# Altium schematic sheet Sheet1.SchDoc
size A4; SheetNumber: 1; SheetTotal: 1
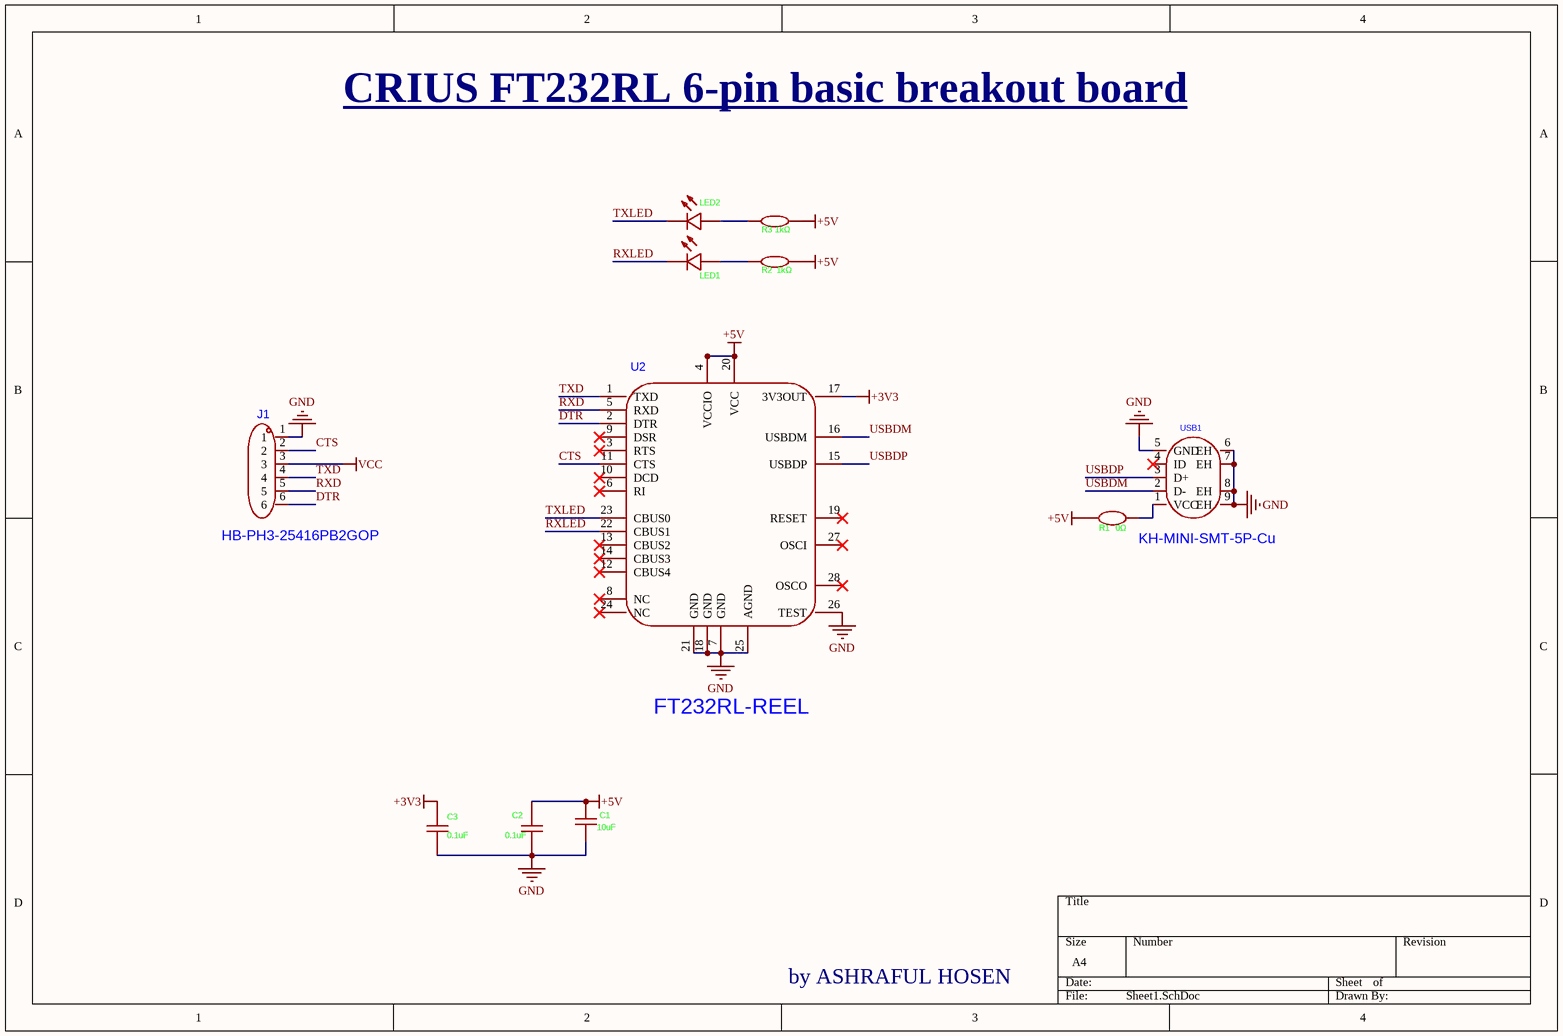
[diagram p0: Sheet1.SchDoc]

## Parts
C1  10uF  [C1206]
C2  0.1uF  [C0603]
C3  0.1uF  [C0603]
J1  HB-PH3-25416PB2GOP  [HDR-TH_6P-P2.54-V-M]
LED1  19-217/R6C-AL1M2VY/3T  [LED0603-RD]  (value not drawn)
LED2  19-217/R6C-AL1M2VY/3T  [LED0603-RD]  (value not drawn)
R1  0Ω  [R0805]
R2  1kΩ  [R0603]
R3  1kΩ  [R0603]
U2  FT232RL-REEL  [SSOP-28_L10.2-W5.3-P0.65-LS7.8-BL]
USB1  KH-MINI-SMT-5P-Cu  [MINI-USB-SMD_KH-MINI-SMT-5P-CU]

## Nets
+3V3: C3.2 U2.17(3V3OUT)
+5V: C1.2 C2.2 R1.1 R2.2 R3.2 U2.4(VCCIO) U2.20(VCC)
GND: C1.1 C2.1 C3.1 J1.1 U2.7(GND) U2.18(GND) U2.21(GND) U2.25(AGND) U2.26(TEST) USB1.5(GND) USB1.6(EH) USB1.7(EH) USB1.8(EH) USB1.9(EH)
VCC: J1.3
CTS: J1.2 U2.11(CTS)
DTR: J1.6 U2.2(DTR)
RXD: J1.5 U2.5(RXD)
RXLED: LED1.1(C) U2.22(CBUS1)
TXD: J1.4 U2.1(TXD)
TXLED: LED2.1(C) U2.23(CBUS0)
USBDM: U2.16(USBDM) USB1.2(D-)
USBDP: U2.15(USBDP) USB1.3(D+)
NetLED1_2: LED1.2(A) R2.1
NetLED2_2: LED2.2(A) R3.1
NetR1_2: R1.2 USB1.1(VCC)

Not connected (* = marked no-connect by the designer): U2 3(RTS)* 6(RI)* 8(NC)* 9(DSR)* 10(DCD)* 12(CBUS4)* 13(CBUS2)* 14(CBUS3)* 19(RESET)* 24(NC)* 27(OSCI)* 28(OSCO)*; USB1 4(ID)*

## Notes on the sheet
- CRIUS FT232RL 6-pin basic breakout board
- by ASHRAFUL HOSEN

## Library data of the parts
C1 = CL31A106KBHNNNE: 50V 10uF X5R ±10% 1206 Multilayer Ceramic Capacitors MLCC - SMD/SMT ROHS; Manufacturer: SAMSUNG(三星); Add into BOM: yes; Symbol: CL31A106KBHNNNE; Device: CL31A106KBHNNNE; LCSC Part Name: 10uF ±10% 50V; Supplier Part: C13585; Manufacturer Part: CL31A106KBHNNNE; Supplier Footprint: 1206; JLCPCB Part Class: Basic Part; Datasheet: https://atta.szlcsc.com/upload/public/pdf/source/20160218/1457707763339.pdf; Supplier: LCSC; Convert to PCB: yes; Value: 10uF; Tolerance: ±10%
C2 C3 = CC0603KRX7R9BB104: 50V 100nF X7R ±10% 0603 Multilayer Ceramic Capacitors MLCC - SMD/SMT ROHS; Manufacturer: YAGEO(国巨); Add into BOM: yes; Symbol: CC0603KRX7R9BB104; Device: CC0603KRX7R9BB104; LCSC Part Name: 100nF ±10% 50V; Supplier Part: C14663; Manufacturer Part: CC0603KRX7R9BB104; Supplier Footprint: 0603; JLCPCB Part Class: Basic Part; Datasheet: https://atta.szlcsc.com/upload/public/pdf/source/20180910/C282072_33301C7F631E79921B82A8DAC6BCC5B3.pdf; Supplier: LCSC; Convert to PCB: yes; Value: 100nF; Tolerance: ±10%; Voltage Rating: 50V; Temperature Coefficient: X7R
J1 = HB-PH3-25416PB2GOP: Gold 250V 3A Through Hole Pin Header 2.54mm 6P 6mm -40℃~+105℃ 3mm 2.54mm Brass Black 1 1x6P 2.54mm Plugin,P=2.54mm Pin Headers ROHS; Manufacturer: HANBO(汉博); Add into BOM: yes; Circluar Pins/Square Pins: Policy; Symbol: HB-PH3-25416PB2GOP; Device: HB-PH3-25416PB2GOP; LCSC Part Name: 1x6P 间距:2.54mm 方针 直插; Supplier Part: C6332199; Manufacturer Part: HB-PH3-25416PB2GOP; Supplier Footprint: 插件,P=2.54mm; JLCPCB Part Class: Extended Part; Datasheet: https://atta.szlcsc.com/upload/public/pdf/source/20230803/F72D259687963761DF1B552F3BB84A31.pdf; Supplier: LCSC; Convert to PCB: yes; Pin Structure: 1x6P; Pitch: 2.54mm; Row Spacing: 2.54mm; Mounting Type: Straight; Number of Rows: Single Row; Number of Pins: 6P; Current Rating: 3A; Voltage Rating (Max): 250V; Length of Mating Pin: 6mm; Insulation Height: 2.54mm; Length of End Connection Pin: 3mm; Contact Material: Brass; Contact Plating: Gold; Operating Temperature: -40℃~+105℃; Color: Black
LED1 LED2 = 19-217/R6C-AL1M2VY/3T: 5mA Water Clear -40℃~+85℃ 617.5nm Red 120° 60mW 1.95V 0603 LED Indication - Discrete ROHS; Manufacturer: EVERLIGHT(亿光); Add into BOM: yes; Peak Wavelength: 632nm; Lens Color: Colorless Transparent Lens; Symbol: 19-217/R6C-AL1M2VY/3T; Device: 19-217/R6C-AL1M2VY/3T; LCSC Part Name: 红灯 停产 停产; Supplier Part: C72044; Manufacturer Part: 19-217/R6C-AL1M2VY/3T; Supplier Footprint: 0603; JLCPCB Part Class: Extended Part; Datasheet: https://atta.szlcsc.com/upload/public/pdf/source/20160507/1462613613821.pdf; Supplier: LCSC; Convert to PCB: yes; Emitted Color: Red; Forward Voltage (VF): 1.95V; Power Dissipation: 60mW; Forward Current: 5mA; Dominant Wavelength: 617.5nm; Diode Configuration: -; Color Temperature: -; Viewing Angle: 120°; Mounting Sytle: -; Operating Temperature: -40℃~+85℃
R1 = FRC0805P000 TS: 125mW Thick Film Resistor 150V ±5% 0Ω 0805 Chip Resistor - Surface Mount ROHS; Manufacturer: FOJAN(富捷); Add into BOM: yes; Symbol: FRC0805P000 TS; Device: FRC0805P000 TS; LCSC Part Name: 0Ω ±5% 125mW 厚膜电阻; Supplier Part: C2907288; Manufacturer Part: FRC0805P000 TS; Supplier Footprint: 0805; JLCPCB Part Class: Extended Part; Datasheet: https://atta.szlcsc.com/upload/public/pdf/source/20211221/925EC7D7225764EE0046F22065062C87.pdf; Supplier: LCSC; Convert to PCB: yes; Type: Thick Film Resistors; Value: 0Ω; Tolerance: ±5%; Operating Temperature Range: -55℃~+155℃
R2 R3 = RC0603FR-071KL: 100mW Thick Film Resistor 75V ±100ppm/℃ ±1% 1kΩ 0603 Chip Resistor - Surface Mount ROHS; Manufacturer: YAGEO(国巨); Add into BOM: yes; Symbol: RC0603FR-071KL; Device: RC0603FR-071KL; LCSC Part Name: 厚膜电阻 1kΩ ±1% 100mW; Supplier Part: C22548; Manufacturer Part: RC0603FR-071KL; Supplier Footprint: 0603; JLCPCB Part Class: Extended Part; Datasheet: https://atta.szlcsc.com/upload/public/pdf/source/20180316/70C0E2BDAE7FCC62C531A5A58D202EE1.pdf; Supplier: LCSC; Convert to PCB: yes; Type: Thick Film Resistors; Value: 1kΩ; Tolerance: ±1%; Power(Watts): 100mW; Voltage-Supply(Max): 75V; Temperature Coefficient: ±100ppm/℃; Operating Temperature: -55℃~+155℃
U2 = FT232RL-REEL: USB to UART SSOP-28-208mil USB Converters ROHS; Manufacturer: FTDI(飞特帝亚); Add into BOM: yes; Voltage - Supply: 3.3V~5.25V; Symbol: FT232RL-REEL; Device: FT232RL-REEL; LCSC Part Name: FT232R USB UART 芯片 停产; Supplier Part: C8690; Manufacturer Part: FT232RL-REEL; Supplier Footprint: SSOP-28-208mil; JLCPCB Part Class: Extended Part; Datasheet: https://atta.szlcsc.com/upload/public/pdf/source/20130221/1457706592200.pdf; Supplier: LCSC; Convert to PCB: yes; Applications Function: USB to UART; Protocol: -; Operating Temperature: -40℃~+85℃
USB1 = KH-MINI-SMT-5P-Cu: 1A USB 2.0 1 Surface Mount, Right Angle 5P Female Mini-B SMD USB Connectors ROHS; Manufacturer: kinghelm(金航标); Add into BOM: yes; Number of Ports: 1; Symbol: KH-MINI-SMT-5P-CU; Device: KH-MINI-SMT-5P-Cu; LCSC Part Name: Mini-B 母 卧贴; Supplier Part: C2688795; Manufacturer Part: KH-MINI-SMT-5P-Cu; Supplier Footprint: SMD; JLCPCB Part Class: Extended Part; Datasheet: https://atta.szlcsc.com/upload/public/pdf/source/20210202/C2688795_BF0BB16DAD2ABFC9845DEEA6AC1A1F9C.pdf; Supplier: LCSC; Convert to PCB: yes; Connector Type: Mini-B; Standard: USB 2.0; Gender: Female; Number of Contacts: 5P; Mounting Style: 卧贴; Current Rating - Power (Max): 1A; Contact Material: -; Contact Plating: -; Operating Temperature Range: -; Soldering Temperature(Max): -